# EAGLE design Adafruit LIPoly Charger BFF rev C (EAGLE 9.6.2)
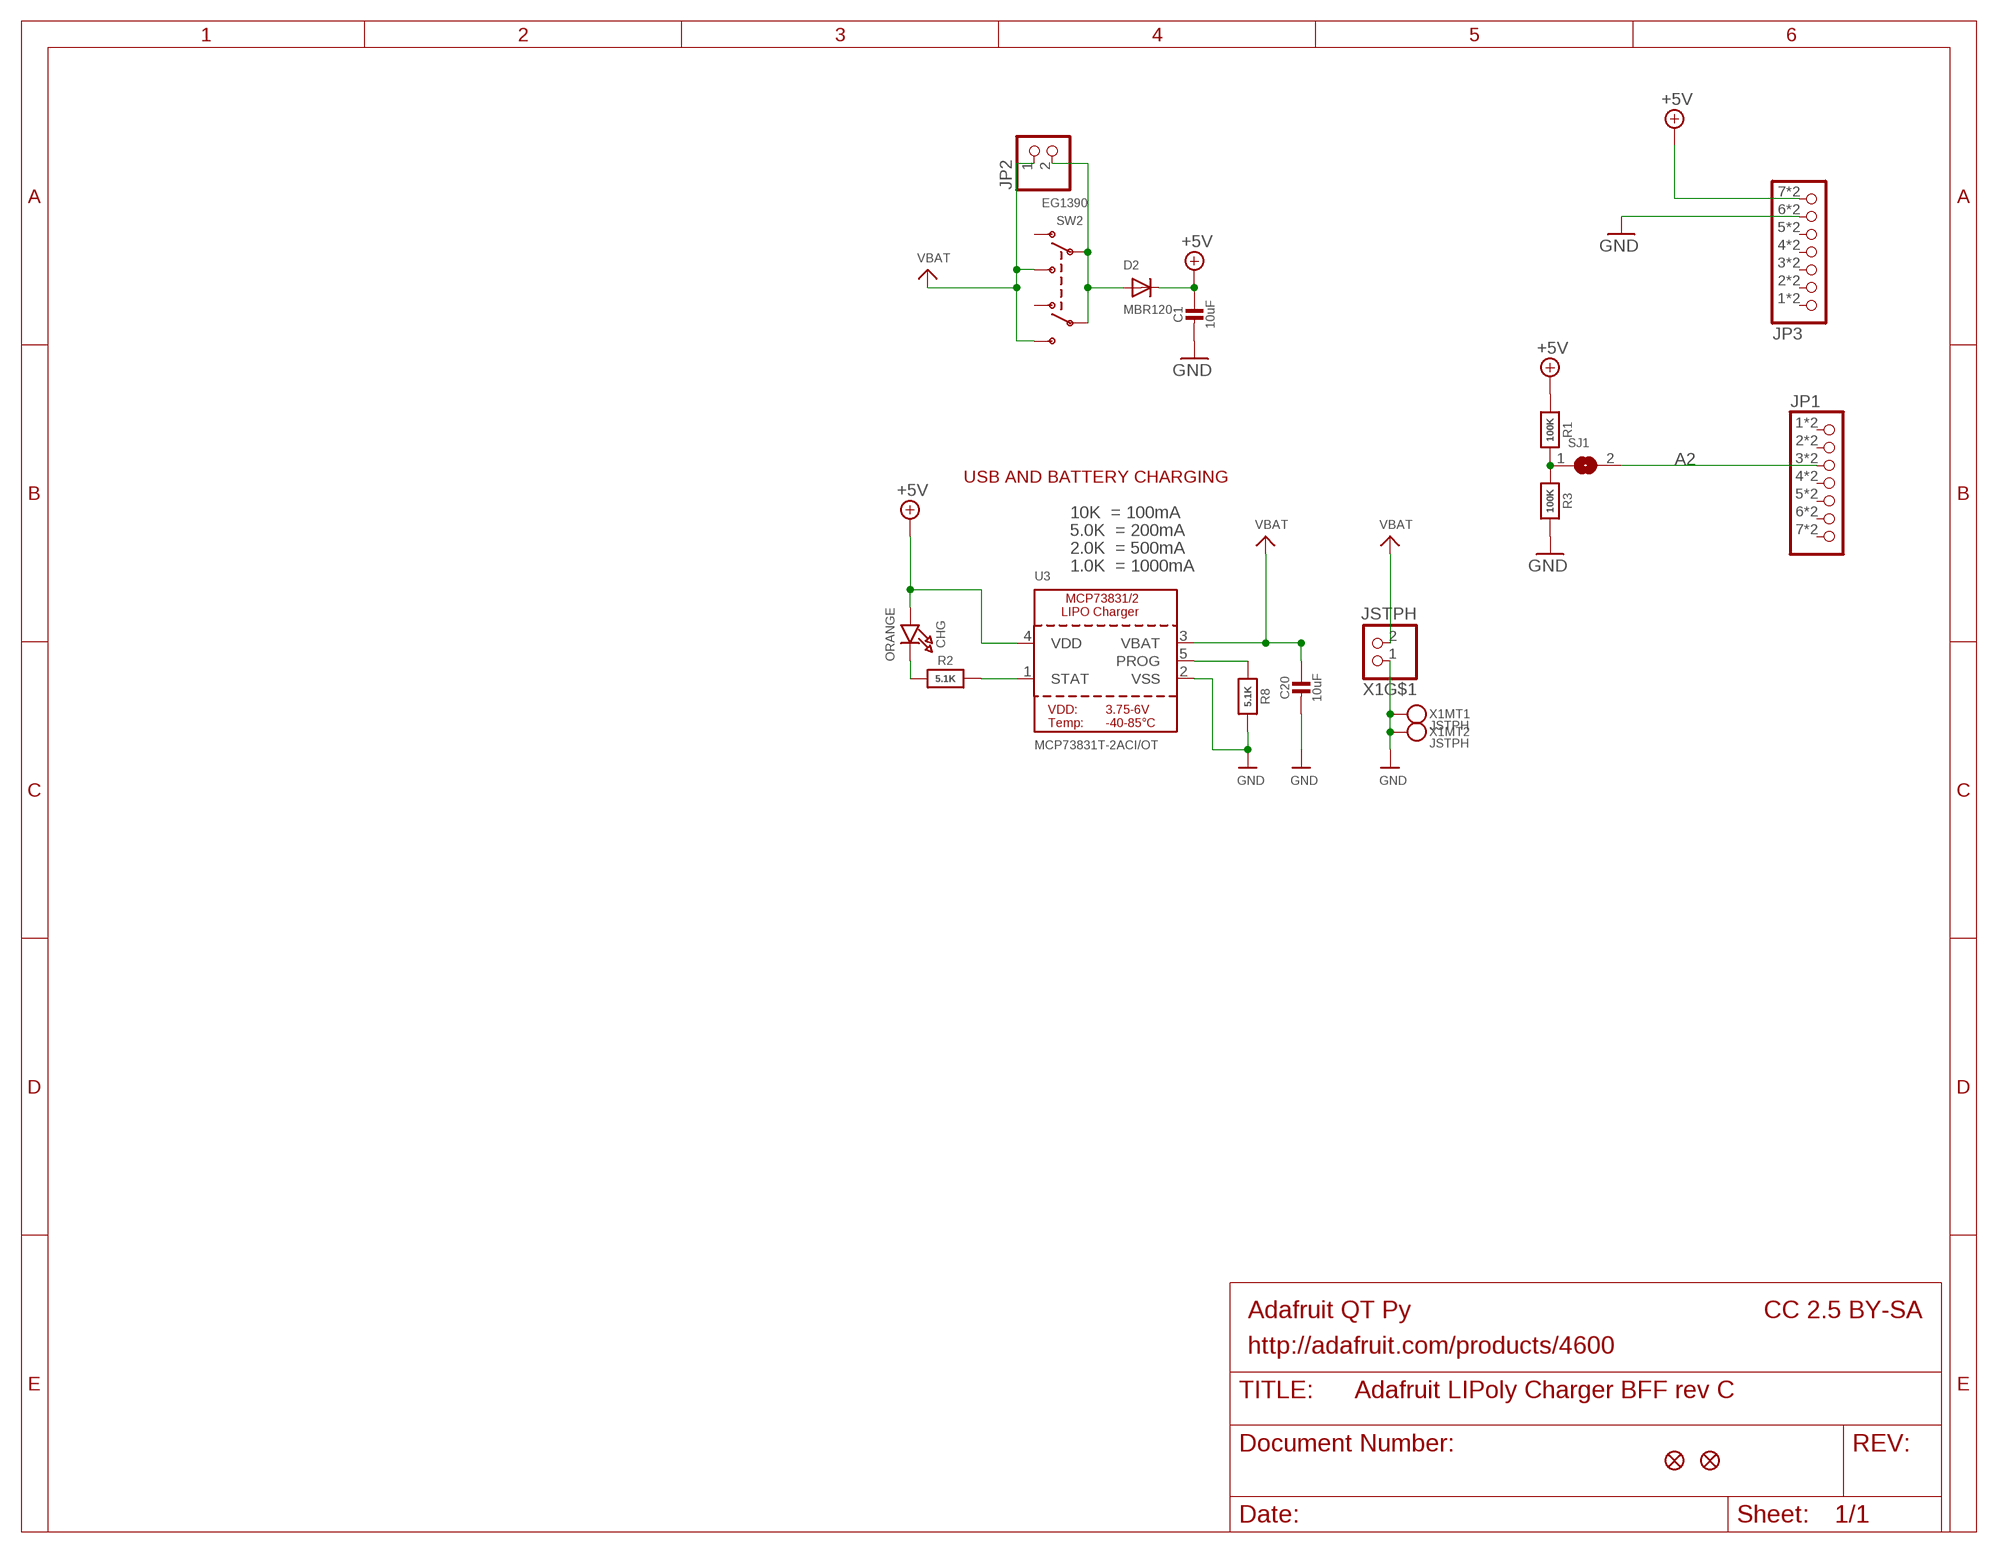
[diagram p0: schematic, sheet 1]

## Parts
C1  10uF  CAP_CERAMIC0805-NOOUTLINE  [0805-NO]
C20  10uF  CAP_CERAMIC0805-NOOUTLINE  [0805-NO]
CHG  ORANGE  LED0603_NOOUTLINE  [CHIPLED_0603_NOOUTLINE]
D2  MBR120  DIODE_SOD-123FL  [SOD-123FL]
JP1  HEADER-1X7_CASTEL  [1X07_CASTEL]
JP2  HEADER-1X2ROUND  [1X02_ROUND]
JP3  HEADER-1X7_CASTEL  [1X07_CASTEL]
R1  100K  RESISTOR_0603_NOOUT  [0603-NO]
R2  5.1K  RESISTOR_0603_NOOUT  [0603-NO]
R3  100K  RESISTOR_0603_NOOUT  [0603-NO]
R8  5.1K  RESISTOR_0603_NOOUT  [0603-NO]
SJ1  SOLDERJUMPERCLOSED  [SOLDERJUMPER_CLOSEDWIRE]
SW2  EG1390  SWITCH_DPDTEG1390  [EG1390]
U3  MCP73831T-2ACI/OT  MCP73831/2  [SOT23-5]
U$6  FIDUCIAL_0.5MM  [FIDUCIAL_0.5MM]
U$8  FIDUCIAL_0.5MM  [FIDUCIAL_0.5MM]
X1  JSTPH  CON_JST_PH_2PIN_MT_BATT  [JSTPH2_BATT]

## Nets
+5V [power]: C1.1 CHG.A D2.C JP3.7 JP3.7C R1.1 U3.4(VDD)
A2: JP1.3 JP1.3C SJ1.2
GND [power]: C1.2 C20.2 JP3.6 JP3.6C R3.2 R8.2 U3.2(VSS) X1.1 X1.NC1 X1.NC2
N$1: R1.2 R3.1 SJ1.1
N$2: CHG.C R2.1
N$3: R2.2 U3.1(STAT)
N$4: R8.1 U3.5(PROG)
N$7 [power]: D2.A JP2.2 SW2.P1 SW2.P2
VBAT [power]: C20.1 JP2.1 SW2.S1 SW2.S2 U3.3(VBAT) X1.2
Unconnected: JP1.1 JP1.1C JP1.2 JP1.2C JP1.4 JP1.4C JP1.5 JP1.5C JP1.6 JP1.6C JP1.7 JP1.7C JP3.1 JP3.1C JP3.2 JP3.2C JP3.3 JP3.3C JP3.4 JP3.4C JP3.5 JP3.5C SW2.O1 SW2.O2

## Notes on the sheet
- USB AND BATTERY CHARGING
- 10K  = 100mA
- 5.0K  = 200mA
- 2.0K  = 500mA
- 1.0K  = 1000mA
- Adafruit QT Py | CC 2.5 BY-SA
- http://adafruit.com/products/4600

## Library data of the parts
C1 C20 = microbuilder:CAP_CERAMIC: Ceramic Capacitors For new designs, use the packages preceded by an '_' character since they are more reliable: The following footprints should be used on most boards: _0402 - Standard footprint for regular board layouts _0603 - Standard footprint for regular board layouts _0805 - Standard footprint for regular board layouts _1206 - Standard footprint for regular board layouts For extremely tight-pitch boards where space is at a premium, the following 'micro-pitch' footprints can be used (smaller pads, no silkscreen outline, etc.): _0402MP - Micro-pitch footprint for very dense/compact boards _0603MP - Micro-pitch footprint for very dense/compact boards _0805MP - Micro-pitch footprint for very dense/compact boards _1206MP - Micro-pitch footprint for very dense/compact boards
CHG = microbuilder:LED: LED 0603 - 0603 Surface Mount Package 2mA: Green LED - Low Power (3.9mcd, 2ma, 1.7Vf) - Digikey: 475-2709-2-ND Orange LED - Low Power (9.8mcd, 2ma, 1.8Vf) - Digikey: 475-1194-2-ND Red LED - Low Power (5mcd, 2ma, 1.8Vf) - Digikey: 475-1195-2-ND Yellow LED - Low Power (7mcd, 2ma, 1.8Vf) - Digikey: 475-1196-2-ND 5mA: Blue LED - Low Power (17mcd, 5ma, 2.9Vf) - Digikey: LNJ937W8CRACT-ND 0805 - 0805 Surface Mount Package 2mA: Red LED (8.8mcd, 2mA, 1.8Vf, Clear) - Low Power [Digikey: 475-2510-1-ND] Green LED (5mcd, 2mA, 1.8Vf, Clear) - Low Power [Digikey: 475-2730-1-ND] Yellow LED (11.3mcd, 2mA, 1.8Vf, Clear) - Low Power [Digikey: 475-2555-1-ND] 20mA: Red LED (104mcd, 20mA, Diffused) - LS R976 [Digikey: 475-1278-6-ND] Red LED (12mcd, 20mA, 2.0Vf, Clear) - APT2012EC [Digikey: 754-1128-1-ND] Green LED (15mcd, 20mA, 2.2Vf, Clear) - APT2012GC [Digikey: 754-1131-1-ND] Orange LED (160mcd, 20mA, 2.1Vf, Clear) - APT2012SECK [Digikey: 754-1130-1-ND] 1206 - 1206 Surface Mount Package Green LED (26mcd, 20mA, Diffused) - LG N971 [Digikey: 475-1407-6-ND] Red LED (15mcd, 20mA, Diffused) - LH N974 [Digikey: 475-1416-6-ND] Cree - Cree High-Power Surface Mount LEDs XPEBWT-L1-0000-00D50 - White 111lm 350mA 2.9Vf 6200K 110° XTEAWT-00-0000-00000LEE3 - White 114lm 350mA 2.85Vf 5000K 115° Everlight - Everlight 45-21 Series Surface Mount LEDs 45-21/QK2C-B2832AC2CB2/2T - Warm White 2000mcd 20mA 3.25Vf 3050K 120° 45-21/LK2C-B38452C4CB2/2T - Nuetral White 2000mcd 20mA 3.25Vf 4150K 120° 45-21/LK2C-B50634C6CB2/2T - Cold White 2200mcd 20mA 3.25Vf 5650K 120° PLCC2 Reverse Mount LS T77K-J1L2-1-0-2-R18-Z - Red 11.25mcd 2mA 1.8Vf 630nm 120° LO T77K-L1M2-24-Z - Orange 19.6mcd 2mA 1.8Vf 606nm 120° LY T77K-K2M1-26-Z - Yellow 15.7mcd 2mA 1.8Vf 587nm 120°; ROT: 270
D2 = adafruit:DIODE: Diode SMADIODE - SMA Surface Mount Package 20V 1A Schottky Diode Digikey: 641-1014-6-ND DO-1N4148 - Through Hole Small Current Diode SOD-123 20V 1 A (.5mV Vf) Schottky Diode - Digikey: MBRX120TPMSCT-ND SOD-323 10V 570mA (.38mV Vf, 3ns) Schottky Diode - Digikey: ZLLS410CT-ND SOD-523 30V 30mA Schottky Diode (RB751S-40TE61) - Digikey: RB751S-40TE61CT-ND SOT23-R/W - SOT23 Package (R = Solder Paste/Reflow Ovens, W = Hand-Soldering) BAT54Film 40V 300mA - Digikey: 497-7162-1-ND
JP1 JP3 = adafruit_electromech:HEADER-1X7: PIN HEADER
JP2 = microbuilder:HEADER-1X2: PIN HEADER
R1-R3 R8 = microbuilder:RESISTOR: Resistors For new designs, use the packages preceded by an '_' character since they are more reliable: The following footprints should be used on most boards: _0402 - Standard footprint for regular board layouts _0603 - Standard footprint for regular board layouts _0805 - Standard footprint for regular board layouts _1206 - Standard footprint for regular board layouts For extremely tight-pitch boards where space is at a premium, the following 'micro-pitch' footprints can be used (smaller pads, no silkscreen outline, etc.): _0402MP - Micro-pitch footprint for very dense/compact boards _0603MP - Micro-pitch footprint for very dense/compact boards _0805MP - Micro-pitch footprint for very dense/compact boards _1206MP - Micro-pitch footprint for very dense/compact boards
SJ1 = microbuilder:SOLDERJUMPER: SMD Solder JUMPER Solder the two pads together to create a connection, or remove the solder to break it. REFLOW - Use this footprint for solder paste and reflow ovens. WAVE - Use this footprint for hand-soldering (larger pads). CLOSED - Has a trace between the two pads to ensure it is closed by default. The trace needs to be cut to disable the jumper, and can be closed again by creating a solder bridge between the two pads.
SW2 = adafruit_electromech:SWITCH_DPDT: Switch - DPDT A DPDT Switch acts like an SPDT switch, but has a pair of switches instead of just one. Vertical - 0.3A @ 6V SMT - Digikey: JS202011SCQN; LCSC: C2837066
U3 = microbuilder:MCP73831/2: MCP73831/2 LIPO Charger VDD: 3.75 - 6V Temp -40 - 85°C Programmable Charge Rate: 15-500mA NOTE: STAT is a tri-state logic output on the MCP73831 and an open-drain output on the MCP73832. SOT23-5 with 4.2V output and tri-state logic on STAT = MCP73831T-2ACI/OT; JLC_ROTATION: 270; LCSC: C424093
U$6 U$8 = microbuilder:FIDUCIAL: Fiducial Alignment Points Various fiducial points for machine vision alignment.
X1 = adafruit_electromech:CON_JST_PH_2PIN_MT; LCSC: C47647

## Net classes
1 power: width 0.305 mm
2 gnd: width 0.254 mm

## Board
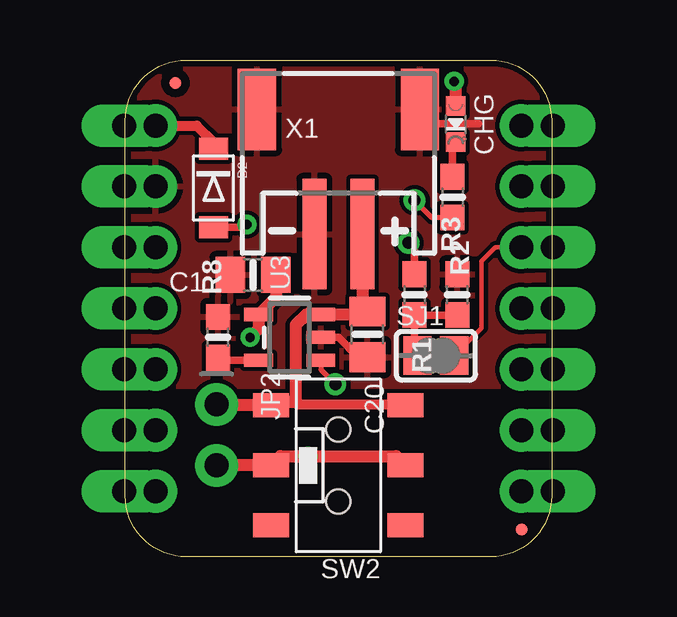
[diagram p1: board, top side]
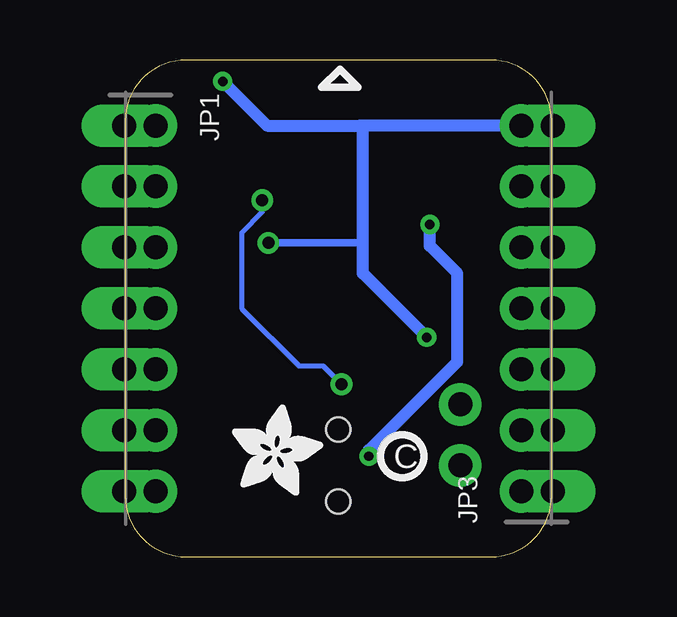
[diagram p2: board, bottom side, seen from below]

Size 17.78 x 20.7 mm. Coordinates in mm from the lower left corner, seen from the top.
Outline: 17.78,18.16 17.78,2.54 arc-90 15.24,0 2.54,0 arc-90 0,2.54 0,18.16 arc-90 2.54,20.7 15.24,20.7 arc-90 17.78,18.16
Copper layers (1*16): Top 0.035mm / dielectric 1.5mm / Bottom 0.035mm
Design rules "adafruit 7-7": minimum track width 7mil, minimum drill 15.5mil, track to track 7mil, track to pad 7mil, pad to pad 7mil, via to via 7mil, smd to smd 7mil, copper to edge 10mil, drill to drill 8mil, minimum pad ring 7mil, minimum via ring 8mil, stop-mask expansion 2mil, vias tented up to drill 20mil, thermal gap 10mil

### Footprints (pad centres in the part's own frame; a part is rotated, then mirrored left to right if it is on the bottom)
0805-NO = smd 1.24 x 1.5: 1 -0.95,0; 2 0.95,0
CHIPLED_0603_NOOUTLINE = smd 0.8 x 0.8: A 0,-0.75; C 0,0.75
SOD-123FL = smd 0.91 x 1.22: A 1.637,0; C -1.637,0
1X07_CASTEL = drill 1 pad 1.778: 1 -7.62,0; 2 -5.08,0; 3 -2.54,0; 4 0,0; 5 2.54,0; 6 5.08,0; 7 7.62,0 | drill 1 pad 1.778 long: 1C -7.62,-1.324; 2C -5.08,-1.324; 3C -2.54,-1.324; 4C 0,-1.324; 5C 2.54,-1.324; 6C 5.08,-1.324; 7C 7.62,-1.324
1X02_ROUND = drill 1 pad 1.778: 1 -1.27,0; 2 1.27,0
0603-NO = smd 1.075 x 1: 1 -0.85,0; 2 0.85,0
SOLDERJUMPER_CLOSEDWIRE = smd 1.168 x 1.6: 1 -0.762,0; 2 0.762,0 | smd 0.635 x 0.203: WIRE 0,0
EG1390 = smd 1 x 1.5: O1 -2.5,2.8; O2 -2.5,-2.8; P1 0,2.8; P2 0,-2.8; S1 2.5,2.8; S2 2.5,-2.8 | hole 1: 1.5,0; -1.5,0
SOT23-5 = smd 0.55 x 1.2: 1 -0.95,-1.3; 2 0,-1.3; 3 0.95,-1.3; 4 0.95,1.3; 5 -0.95,1.3
FIDUCIAL_0.5MM = smd 0.5 x 0.5: 1 0,0
JSTPH2_BATT = smd 1 x 4.6: 1 -1,-2.049; 2 1,-2.049 | smd 1.6 x 3.4: NC1 -3.4,3.151; NC2 3.4,3.151

### Placement (x,y rotation side)
C1  5.33,11.75 180 top
C20  10.1,9.27 270 top
CHG  13.78,18.03 180 top
D2  3.68,15.37 270 top
JP1  16.51,10.35 270 bottom
JP2  3.81,5.08 270 top
JP3  1.27,10.35 90 bottom
PLABEL0  [PLABEL0]  3.49,1.21 0 top
PLABEL1  [PLABEL1]  15.62,19.81 0 top
PLABEL2  [PLABEL2]  12.19,5.08 0 top
PLABEL3  [PLABEL3]  12.57,2.54 0 top
PLABEL4  [PLABEL4]  14.99,2.79 90 top
PLABEL5  [PLABEL5]  14.99,5.46 90 top
PLABEL6  [PLABEL6]  3.43,18.16 0 top
PLABEL7  [PLABEL7]  14.86,15.62 90 top
PLABEL8  [PLABEL8]  14.86,13.08 90 top
PLABEL9  [PLABEL9]  14.86,18.16 90 top
PLABEL10  [PLABEL10]  14.99,10.54 90 top
PLABEL11  [PLABEL11]  14.29,1.14 0 top
PLABEL12  [PLABEL12]  12.32,19.56 0 bottom
PLABEL13  [PLABEL13]  8.76,12.38 0 bottom
PLABEL14  [PLABEL14]  8.76,1.14 0 bottom
R1  12.06,10.92 270 top
R2  13.65,14.99 270 top
R3  13.84,10.92 90 top
R8  3.87,9.14 90 top
SJ1  12.95,8.38 0 top
SW2  8.89,3.81 90 top
U3  6.86,9.14 90 top
U$2  [ADAFRUIT_3.5MM]  13.34,2.54 0 bottom
U$3  [PCBFEAT-REV-040]  6.22,4.19 0 bottom
U$6  16.52,1.14 0 top
U$8  2.1,19.75 0 top
X1  8.89,15.49 0 top

### Tracks (layer width: path | path; a pad name or v marks a point on that pad's centre or on a via)
+5V  (via drill 0.39, 0.5)
  Top 0.305: R1.1 12.06,12.91 11.9,13.08 v11.81,13.08
  Top 0.406: JP3.7C JP3.7 2.98,17.97 3.68,17.27 D2.C
  Top 0.508: v13.72,19.81 13.78,19.75 CHG.A | C1.1 6.28,10.82 U3.4 5.56,9.49 v5.21,9.14
  Bottom 0.305: 7.87,17.84 8,17.97 | v11.81,13.08 7.87,13.08
  Bottom 0.508: JP3.7 8,17.97 11.87,17.97 v13.72,19.81 | v5.21,9.14 7.87,11.81 7.87,13.08 7.87,17.84
A2
  Top 0.178: 16.38,12.89 15.43,12.89 14.86,12.32 14.86,9.53 SJ1.2
  Top 0.406: JP1.3 JP1.3C 16.38,12.89
GND
  Top 0.305: X1.NC2 12.4,18.64 12.99,18.05 14.73,18.05 | U3.2 8.89,9.14 9.71,8.32 C20.2
  Top 0.406: JP3.6C JP3.6
  pour Top: 0,20.7 17.78,20.7 17.78,7.11 0,7.11
N$1
  Top 0.305: R3.1 R1.2 12.06,8.51 SJ1.1
N$2
  Top 0.305: CHG.C 13.65,17.16 R2.1
N$3  (via drill 0.5)
  Top 0.203: U3.1 8.16,7.8 v8.76,7.2 | R2.2 12.79,14.14 v12.06,14.86
  Bottom 0.203: v12.06,14.86 12.06,14.37 12.93,13.51 12.93,10.34 10.54,7.96 9.53,7.96 v8.76,7.2
N$4
  Top 0.305: U3.5 3.97,8.19 R8.1
N$7  (via drill 0.39)
  Top 0.305: D2.A 4.97,13.73 v5.08,13.84
  Top 0.508: SW2.P2 11.31,4.19 v7.62,4.19 6.47,4.19 SW2.P1 JP2.2
  Bottom 0.508: v7.62,4.19 7.62,4.45 3.94,8.13 3.94,11.81 5.08,12.95 v5.08,13.84
VBAT
  Top 0.305: 9.89,10.43 C20.1
  Top 0.406: 7.11,6.44 7.2,6.35 11.65,6.35 SW2.S2
  Top 0.508: X1.2 9.89,10.43 | C20.1 9.97,10.09 U3.3 7.55,10.09 7.11,9.65 7.11,6.44 6.6,6.44 6.48,6.31 SW2.S1 3.85,6.31 JP2.1

### Text on the board
Pinguin_tBackup: chg | 5V | A0 | A1 | A2 | A3 | ON | SCL | OFF | TX | LiPo | BFF
Pinguin_bBackup: MCP73831 / 200mA Lipoly / Charger for / QT Py. Solder / back to back | Battmon on A2